# Altium schematic sheet mPCIe_LoRa_LTE_RS.SchDoc
size 420 x 297 mm; Scale: 1:1; DocumentType: Схема электрическая принципиальная; SheetNumber: 15; SheetTotal: 23; DocumentTypeShort: Э3; DocumentInvertoryNumber: ㅤ
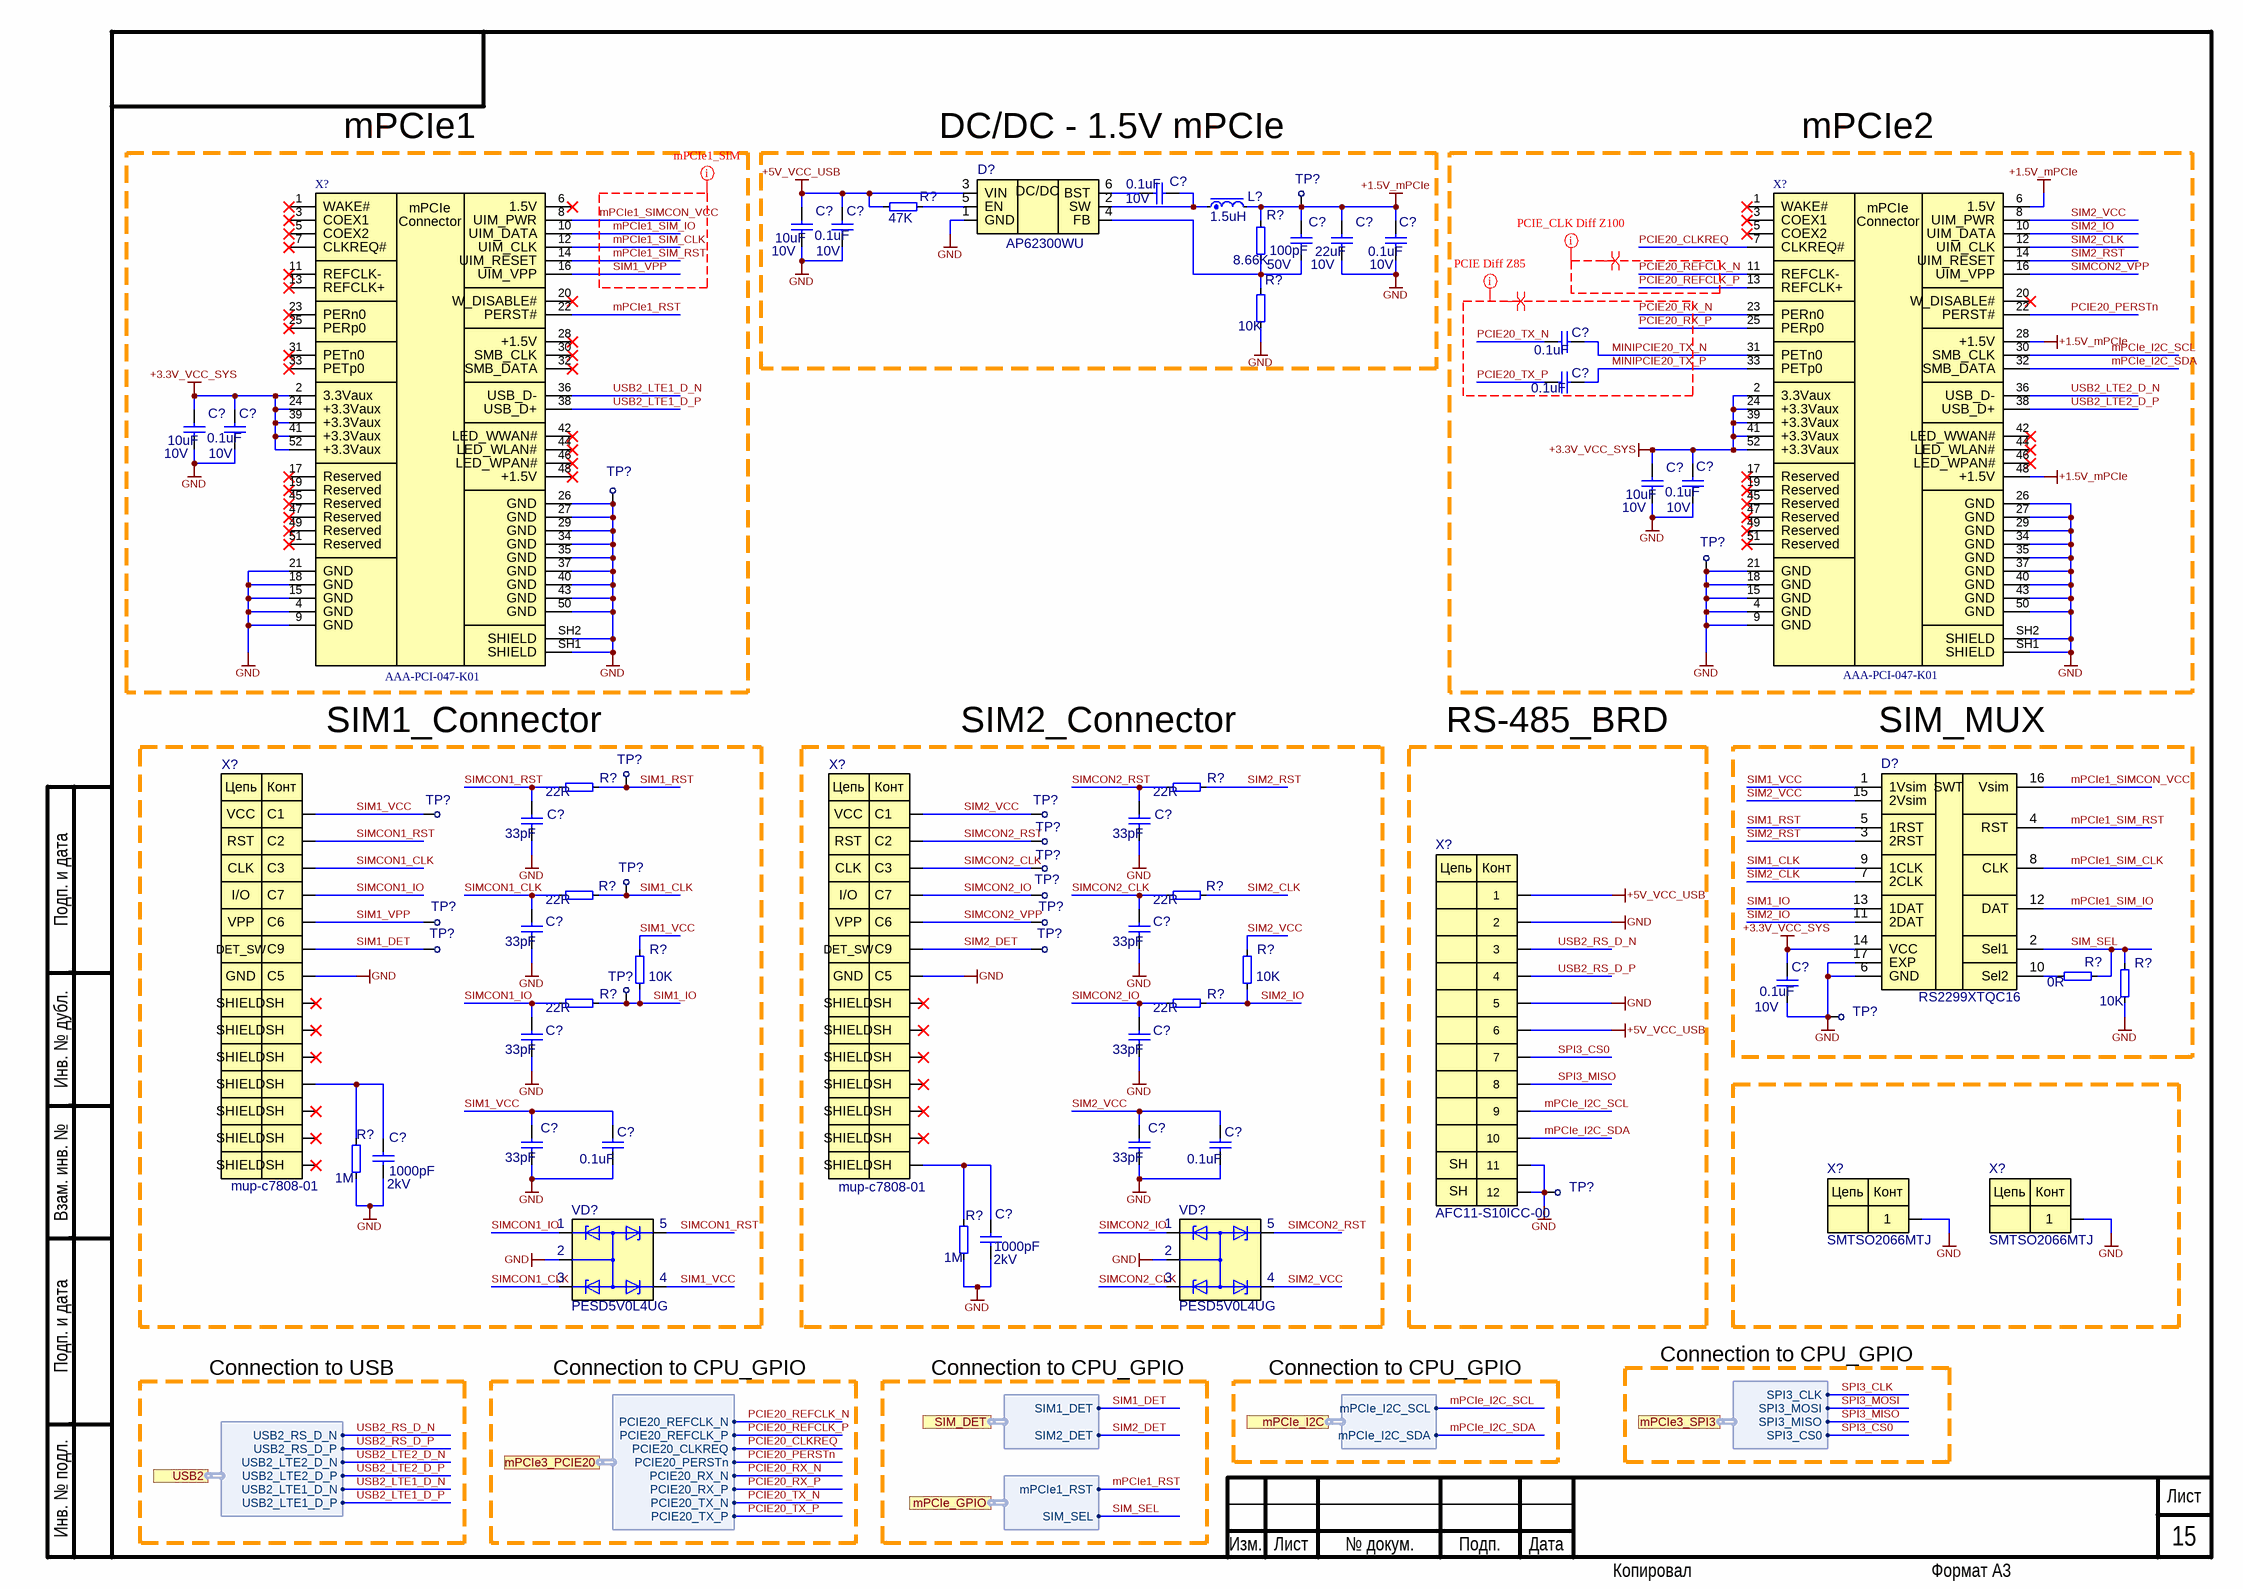
[diagram p0: mPCIe_LoRa_LTE_RS.SchDoc]

## Parts
(Parts that share a designator on the sheet are numbered #1, #2 ... from top to bottom, then left to right.)
C?#1  0.1uF  Voltage: 10V  [C0402]
C?#2  100pF  Voltage: 50V  [C0402]
C?#3  10uF  Voltage: 10V  [C0402]
C?#4  0.1uF  Voltage: 10V  [C0402]
C?#5  22uF  Voltage: 10V  [C0603]
C?#6  0.1uF  Voltage: 10V  [C0402]
C?#7  0.1uF  [C0201]
C?#8  0.1uF  [C0201]
C?#9  10uF  Voltage: 10V  [C0402]
C?#10  0.1uF  Voltage: 10V  [C0402]
C?#11  10uF  Voltage: 10V  [C0402]
C?#12  0.1uF  Voltage: 10V  [C0402]
C?#13  33pF  [C0402]
C?#14  33pF  [C0402]
C?#15  33pF  [C0402]
C?#16  33pF  [C0402]
C?#17  0.1uF  Voltage: 10V  [C0402]
C?#18  33pF  [C0402]
C?#19  33pF  [C0402]
C?#20  33pF  [C0402]
C?#21  0.1uF  [C0402]
C?#22  33pF  [C0402]
C?#23  0.1uF  [C0402]
C?#24  1000pF  Voltage: 2kV  [C1206]
C?#25  1000pF  Voltage: 2kV  [C1206]
D?#1  AP62300WU  [TSOT26]
D?#2  RS2299XTQC16  [RS2299XTQC16]
L?  1.5uH  [L1210]
R?#1  47K  [R_0402]
R?#2  8.66K  [R_0402]
R?#3  10K  [R_0402]
R?#4  22R  [R_0402]
R?#5  22R  [R_0402]
R?#6  22R  [R_0402]
R?#7  22R  [R_0402]
R?#8  0R  [R_0402]
R?#9  10K  [R_0402]
R?#10  10K  [R_0402]
R?#11  22R  [R_0402]
R?#12  22R  [R_0402]
R?#13  10K  [R_0402]
R?#14  1M  [R_1206]
R?#15  1M  [R_1206]
TP?#1  Тестовая точка  [TEST]  (value not drawn)  (no BOM)
TP?#2  Тестовая точка  [TEST]  (value not drawn)  (no BOM)
TP?#3  Тестовая точка  [TEST]  (value not drawn)  (no BOM)
TP?#4  Тестовая точка  [TEST]  (value not drawn)  (no BOM)
TP?#5  Тестовая точка  [TEST]  (value not drawn)  (no BOM)
TP?#6  Тестовая точка  [TEST]  (value not drawn)  (no BOM)
TP?#7  Тестовая точка  [TEST]  (value not drawn)  (no BOM)
TP?#8  Тестовая точка  [TEST]  (value not drawn)  (no BOM)
TP?#9  Тестовая точка  [TEST]  (value not drawn)  (no BOM)
TP?#10  Тестовая точка  [TEST]  (value not drawn)  (no BOM)
TP?#11  Тестовая точка  [TEST]  (value not drawn)  (no BOM)
TP?#12  Тестовая точка  [TEST]  (value not drawn)  (no BOM)
TP?#13  Тестовая точка  [TEST]  (value not drawn)  (no BOM)
TP?#14  Тестовая точка  [TEST]  (value not drawn)  (no BOM)
TP?#15  Тестовая точка  [TEST]  (value not drawn)  (no BOM)
TP?#16  Тестовая точка  [TEST]  (value not drawn)  (no BOM)
TP?#17  Тестовая точка  [TEST]  (value not drawn)  (no BOM)
VD?#1  PESD5V0L4UG  [TSSOP5-5]
VD?#2  PESD5V0L4UG  [TSSOP5-5]
X?#1  AAA-PCI-047-K01  [AAA-PCI-047-K01]
X?#2  AAA-PCI-047-K01  [AAA-PCI-047-K01]
X?#3  mup-c7808-01  [mup-c7808]
X?#4  mup-c7808-01  [mup-c7808]
X?#5  AFC11-S10ICC-00  [AFC11-S10ICC-00]
X?#6  SMTSO2066MTJ  [SMTSO2066MTJ]
X?#7  SMTSO2066MTJ  [SMTSO2066MTJ]

## Ports
mPCIe3_PCIE20 (harness mPCIe3_PCIE20), mPCIe3_SPI3 (harness mPCIe3_SPI3), mPCIe_GPIO (harness mPCIe_GPIO), mPCIe_I2C (harness mPCIe_I2C), SIM_DET (harness SIM_DET), USB2 (harness USB2)

## Harnesses
USB2: USB2_RS_D_P, USB2_RS_D_N, USB2_LTE2_D_P, USB2_LTE2_D_N, USB2_LTE1_D_P, USB2_LTE1_D_N
mPCIe3_PCIE20: PCIE20_REFCLK_P, PCIE20_REFCLK_N, PCIE20_RX_P, PCIE20_RX_N, PCIE20_TX_P, PCIE20_TX_N, PCIE20_PERSTn, PCIE20_CLKREQ
mPCIe_GPIO: SIM_SEL, mPCIe1_RST
SIM_DET: SIM1_DET, SIM2_DET
mPCIe_I2C: mPCIe_I2C_SDA, mPCIe_I2C_SCL
mPCIe3_SPI3: SPI3_MOSI, SPI3_CS0, SPI3_MISO, SPI3_CLK

## Nets
+1.5V_mPCIe: C?#2.1 C?#5.2 C?#6.2 L?.2 R?#2.2 TP?#1.1 X?#2.6(1.5V) X?#2.28(+1.5V) X?#2.48(+1.5V)
+3.3V_VCC_SYS: C?#9.2 C?#10.2 C?#11.2 C?#12.2 C?#17.2 D?#2.14(VCC) X?#1.2(3.3Vaux) X?#1.24(+3.3Vaux) X?#1.39(+3.3Vaux) X?#1.41(+3.3Vaux) X?#1.52(+3.3Vaux) X?#2.2(3.3Vaux) X?#2.24(+3.3Vaux) X?#2.39(+3.3Vaux) X?#2.41(+3.3Vaux) X?#2.52(+3.3Vaux)
+5V_VCC_USB: C?#3.2 C?#4.2 D?#1.3(VIN) R?#1.2 X?#5.1 X?#5.6
GND: C?#3.1 C?#4.1 C?#5.1 C?#6.1 C?#9.1 C?#10.1 C?#11.1 C?#12.1 C?#13.1 C?#14.1 C?#15.1 C?#16.1 C?#17.1 C?#18.1 C?#19.1 C?#20.1 C?#21.1 C?#22.1 C?#23.1 C?#24.1 C?#25.1 D?#1.1(GND) D?#2.6(GND) D?#2.17(EXP) R?#3.1 R?#13.1 R?#14.1 R?#15.1 TP?#2.1 TP?#3.1 TP?#16.1 TP?#17.1 VD?#1.2 VD?#2.2 X?#1.4(GND) X?#1.9(GND) X?#1.15(GND) X?#1.18(GND) X?#1.21(GND) X?#1.26(GND) X?#1.27(GND) X?#1.29(GND) X?#1.34(GND) X?#1.35(GND) X?#1.37(GND) X?#1.40(GND) X?#1.43(GND) X?#1.50(GND) X?#1.SH1(SHIELD) X?#1.SH2(SHIELD) X?#2.4(GND) X?#2.9(GND) X?#2.15(GND) X?#2.18(GND) X?#2.21(GND) X?#2.26(GND) X?#2.27(GND) X?#2.29(GND) X?#2.34(GND) X?#2.35(GND) X?#2.37(GND) X?#2.40(GND) X?#2.43(GND) X?#2.50(GND) X?#2.SH1(SHIELD) X?#2.SH2(SHIELD) X?#3.C5 X?#4.C5 X?#5.2 X?#5.5 X?#5.11 X?#5.12 X?#6.1 X?#7.1
MINIPCIE20_TX_N: C?#7.2 X?#2.31(PETn0)
MINIPCIE20_TX_P: C?#8.2 X?#2.33(РЕТр0)
mPCIe1_RST: X?#1.22(PERST#) ; port mPCIe_GPIO.mPCIe1_RST
mPCIe1_SIM_CLK: D?#2.8(CLK) X?#1.12(UIM_CLK)
mPCIe1_SIM_IO: D?#2.12(DAT) X?#1.10(UIM_DATA)
mPCIe1_SIM_RST: D?#2.4(RST) X?#1.14(UIM_RESET)
mPCIe1_SIMCON_VCC: D?#2.16(Vsim) X?#1.8(UIM_PWR)
mPCIe_I2C_SCL: X?#2.30(SMB_CLK) X?#5.9 ; port mPCIe_I2C.mPCIe_I2C_SCL
mPCIe_I2C_SDA: X?#2.32(SMB_DATA) X?#5.10 ; port mPCIe_I2C.mPCIe_I2C_SDA
PCIE20_CLKREQ: X?#2.7(CLKREQ#) ; port mPCIe3_PCIE20.PCIE20_CLKREQ
PCIE20_PERSTn: X?#2.22(PERST#) ; port mPCIe3_PCIE20.PCIE20_PERSTn
PCIE20_REFCLK_N: X?#2.11(REFCLK-) ; port mPCIe3_PCIE20.PCIE20_REFCLK_N
PCIE20_REFCLK_P: X?#2.13(REFCLK+) ; port mPCIe3_PCIE20.PCIE20_REFCLK_P
PCIE20_RX_N: X?#2.23(PERn0) ; port mPCIe3_PCIE20.PCIE20_RX_N
PCIE20_RX_P: X?#2.25(PERp0) ; port mPCIe3_PCIE20.PCIE20_RX_P
PCIE20_TX_N: C?#7.1 ; port mPCIe3_PCIE20.PCIE20_TX_N
PCIE20_TX_P: C?#8.1 ; port mPCIe3_PCIE20.PCIE20_TX_P
SIM1_CLK: D?#2.9(1CLK) R?#6.2 TP?#9.1
SIM1_DET: TP?#13.1 X?#3.C9 ; port SIM_DET.SIM1_DET
SIM1_IO: D?#2.13(1DAT) R?#9.1 R?#11.2 TP?#15.1
SIM1_RST: D?#2.5(1RST) R?#4.2 TP?#4.1
SIM1_VCC: C?#20.2 C?#21.2 D?#2.1(1Vsim) R?#9.2 TP?#5.1 VD?#1.4 X?#3.C1
SIM1_VPP: TP?#11.1 X?#1.16(UIM_VPP) X?#3.C6
SIM2_CLK: D?#2.7(2CLK) R?#7.2 X?#2.12(UIM_CLK)
SIM2_DET: TP?#14.1 X?#4.C9 ; port SIM_DET.SIM2_DET
SIM2_IO: D?#2.11(2DAT) R?#10.1 R?#12.2 X?#2.10(UIM_DATA)
SIM2_RST: D?#2.3(2RST) R?#5.2 X?#2.14(UIM_RESET)
SIM2_VCC: C?#22.2 C?#23.2 D?#2.15(2Vsim) R?#10.2 TP?#6.1 VD?#2.4 X?#2.8(UIM_PWR) X?#4.C1
SIM_SEL: D?#2.2(Sel1) R?#8.2 R?#13.2 ; port mPCIe_GPIO.SIM_SEL
SIMCON1_CLK: C?#15.2 R?#6.1 VD?#1.3 X?#3.C3
SIMCON1_IO: C?#18.2 R?#11.1 VD?#1.1 X?#3.C7
SIMCON1_RST: C?#13.2 R?#4.1 VD?#1.5 X?#3.C2
SIMCON2_CLK: C?#16.2 R?#7.1 TP?#8.1 VD?#2.3 X?#4.C3
SIMCON2_IO: C?#19.2 R?#12.1 TP?#10.1 VD?#2.1 X?#4.C7
SIMCON2_RST: C?#14.2 R?#5.1 TP?#7.1 VD?#2.5 X?#4.C2
SIMCON2_VPP: TP?#12.1 X?#2.16(UIM_VPP) X?#4.C6
SPI3_CLK: port mPCIe3_SPI3.SPI3_CLK
SPI3_CS0: X?#5.7 ; port mPCIe3_SPI3.SPI3_CS0
SPI3_MISO: X?#5.8 ; port mPCIe3_SPI3.SPI3_MISO
SPI3_MOSI: port mPCIe3_SPI3.SPI3_MOSI
USB2_LTE1_D_N: X?#1.36(USB_D-) ; port USB2.USB2_LTE1_D_N
USB2_LTE1_D_P: X?#1.38(USB_D+) ; port USB2.USB2_LTE1_D_P
USB2_LTE2_D_N: X?#2.36(USB_D-) ; port USB2.USB2_LTE2_D_N
USB2_LTE2_D_P: X?#2.38(USB_D+) ; port USB2.USB2_LTE2_D_P
USB2_RS_D_N: X?#5.3 ; port USB2.USB2_RS_D_N
USB2_RS_D_P: X?#5.4 ; port USB2.USB2_RS_D_P
NetC?#1_1: C?#1.1 D?#1.2(SW) L?.1
NetC?#1_2: C?#1.2 D?#1.6(BST)
NetC?#2_2: C?#2.2 D?#1.4(FB) R?#2.1 R?#3.2
NetC?#24_2: C?#24.2 R?#14.2 X?#3.SH4(SH)
NetC?#25_2: C?#25.2 R?#15.2 X?#4.SH7(SH)
NetD?#1_5: D?#1.5(EN) R?#1.1
NetD?#2_10: D?#2.10(Sel2) R?#8.1

Not connected (* = marked no-connect by the designer): X?#1 1(WAKE#)* 3(СОЕХ1)* 5(СОЕХ2)* 6(1.5V)* 7(CLKREQ#)* 11(REFCLK-)* 13(REFCLK+)* 17(Reserved)* 19(Reserved)* 20(W_DISABLE#)* 23(PERn0)* 25(PERp0)* 28(+1.5V)* 30(SMB_CLK)* 31(PETn0)* 32(SMB_DATA)* 33(РЕТр0)* 42(LED_WWAN#)* 44(LED_WLAN#)* 45(Reserved)* 46(LED_WPAN#)* 47(Reserved)* 48(+1.5V)* 49(Reserved)* 51(Reserved)*; X?#2 1(WAKE#)* 3(СОЕХ1)* 5(СОЕХ2)* 17(Reserved)* 19(Reserved)* 20(W_DISABLE#)* 42(LED_WWAN#)* 44(LED_WLAN#)* 45(Reserved)* 46(LED_WPAN#)* 47(Reserved)* 49(Reserved)* 51(Reserved)*; X?#3 SH1(SH)* SH2(SH)* SH3(SH)* SH5(SH)* SH6(SH)* SH7(SH)*; X?#4 SH1(SH)* SH2(SH)* SH3(SH)* SH4(SH)* SH5(SH)* SH6(SH)*

## Layout directives
net class mPCIe1_SIM: mPCIe1_SIM_CLK, mPCIe1_SIM_IO, mPCIe1_SIM_RST, mPCIe1_SIMCON_VCC, SIM1_VPP
rule Differential Pairs Routing [Pref Gap = 0.127mm    Min Gap  = 0.127mm    Max Gap  = 0.127mmPref Width = 0.12mm    Min Width  = 0.12mm    Max Width  = 0.14mm]; net class PCIE_Z85: MINIPCIE20_TX_N, MINIPCIE20_TX_P, PCIE20_RX_N, PCIE20_RX_P, PCIE20_TX_N, PCIE20_TX_P
differential pair: MINIPCIE20_TX_N, MINIPCIE20_TX_P, PCIE20_REFCLK_N, PCIE20_REFCLK_P, PCIE20_RX_N, PCIE20_RX_P, PCIE20_TX_N, PCIE20_TX_P
rule Differential Pairs Routing [Pref Gap = 0.2mm    Min Gap  = 0.127mm    Max Gap  = 0.24mmPref Width = 0.11mm    Min Width  = 0.1mm    Max Width  = 0.12mm]; net class PCIE_CLK: PCIE20_REFCLK_N, PCIE20_REFCLK_P

## Notes on the sheet
- mPCIe1
- DC/DC - 1.5V mPCIe
- mPCIe2
- SIM1_Connector
- SIM2_Connector
- RS-485_BRD
- SIM_MUX
- Connection to USB
- Connection to CPU_GPIO
- Подп. и дата
- Инв. № дубл.
- Взам. инв. №
- Инв. № подл.
- Изм.
- Лист
- № докум.
- Подп.
- Дата
- Копировал
- Формат А3
- (in symbol AAA-PCI-047-K01) mPCIe; Connector
- (in symbol AFC11-S10ICC-00) Цепь; Конт; SH
- (in symbol AP62300WU) DC/DC
- (in symbol mup-c7808) Цепь; Конт; VCC; RST; CLK; I/O; VPP; DET_SW; GND; SHIELD
- (in symbol RS2299XTQC16) SWT
- (in symbol SMTSO2066MTJ) Цепь; Конт

## Library data of the parts
C?#1 C?#4 C?#6 C?#10 C?#12 C?#17 = 0402-X7R-16V-0.1uF±10%: Part Number: 0402-X5R-10V-0.1uF±10%; Manufacturer: Yageo; NameFromManufacturer: CC0402KRX5R6BB104; Place: S; Tolerance: 10%; Check: False; Value: 0.1uF; Temperature: -55°C~125°C; ComponentLink2Description: Link to datasheet; ComponentLink1Description: DATASHEET; Last changed: 27.10.2022
C?#2 = 0402-NP0-50V-100pF±5%: *; Manufacturer: Yageo; NameFromManufacturer: CC0402JRNPO9BN101; Place: S; Tolerance: 5%; Check: False; Part Number: 0402-NP0-50V-100pF±5%; Value: 100pF; Temperature: -55°C~125°C; ComponentLink2Description: Link to datasheet; ComponentLink1Description: DATASHEET; ComponentLink2URL: https://www.terraelectronica.ru/product/367375; ComponentLink1URL: Datasheets/capacitors/UPY-GP_NP0_16V-to-50V_18.pdf; Last changed: 27.10.2022
C?#3 C?#9 C?#11 = 0402-X5R-10V-10uF±20: *; Manufacturer: Samsung; NameFromManufacturer: CL05A106MP5NUNC; Place: S; Tolerance: 20%; Check: False; Part Number: 0402-X5R-10V-10uF±20; Value: 10uF; Temperature: -55°C~85°C; ComponentLink2Description: Link to datasheet; ComponentLink1Description: DATASHEET; Last changed: 06.04.2023
C?#5 = 0603-X5R-10V-22uF±20%: *; Manufacturer: Murata; NameFromManufacturer: GRM188R61A226ME15D; Place: S; Tolerance: 20%; Part Number: 0603-X5R-10V-22uF±20%; Value: 22uF; Temperature: -55°C~85°C; ComponentLink2Description: Link to datasheet; ComponentLink1Description: DATASHEET
C?#7 C?#8 = 0201-X5R-25V-0.1uF±10%: Manufacturer: Yageo; NameFromManufacturer: CC0201KRX5R8BB104; Place: S; Voltage: 25V; Tolerance: 10%; Check: False; Part Number: 0201-X5R-25V-0.1uF±10%; Value: 0.1uF; Temperature: -55°C~85°C; ComponentLink2Description: Link to datasheet; ComponentLink1Description: DATASHEET; ComponentLink2URL: https://octopart.com/cc0201krx5r8bb104-yageo-88496683?r=sp; ComponentLink1URL: Datasheets/capacitors/UPY-GPHC_X5R_4V-to-50V_26.pdf; Last changed: 27.10.2022
C?#13-C?#16 C?#18-C?#20 C?#22 = 0402-NP0-50V-033pF±5%: Manufacturer: Yageo; NameFromManufacturer: CC0402JRNPO9BN330; Place: S; Voltage: 50V; Tolerance: 5%; Check: False; Annotation: *; Param: *; Value: 33pF; Part Number: 0402-NP0-50V-033pF±5%; Temperature: -55°C~125°C; ComponentLink1Description: DATASHEET; ComponentLink1URL: https://ru.mouser.com/ProductDetail/YAGEO/CC0402JRNPO9BN330?qs=%2Fha2pyFadugad28DmURO4SjHY55hse1%2FbIxH0hu%252BjwDDDqlPhfn26g%3D%3D; Datasheet: #https://www.yageo.com/upload/media/product/productsearch/datasheet/mlcc/UPY-GP_NP0_16V-to-50V_18.pdf#; Last changed: 07.10.2021
C?#21 C?#23 = 0402-X7R-16V-0.1uF±10%: Manufacturer: Yageo; NameFromManufacturer: CC0402JRX7R7BB104; Place: S; Voltage: 16V; Tolerance: 10%; Check: False; Annotation: *; Param: *; Value: 0.1uF; Part Number: 0402-X7R-16V-0.1uF±10%; Temperature: -55°C~125°C; ComponentLink1Description: DATASHEET; ComponentLink1URL: https://www.yageo.com/upload/media/product/productsearch/datasheet/mlcc/UPY-GPHC_X7R_6.3V-to-50V_18.pdf; Datasheet: #https://www.yageo.com/upload/media/product/productsearch/datasheet/mlcc/UPY-GPHC_X7R_6.3V-to-50V_18.pdf#; Last changed: 31.03.2021
C?#24 C?#25 = 1206-X7R-2K-1000pF±10%: Manufacturer: Walsin; NameFromManufacturer: 1206B102K202; Place: S; Tolerance: 10%; Check: False; Part Number: 1206-X7R-2K-1000pF±10%; Value: 1000pF; Temperature: -55°C~125°C; ComponentLink2Description: Link to datasheet; ComponentLink1Description: DATASHEET; ComponentLink2URL: https://www.lcsc.com/product-detail/Multilayer-Ceramic-Capacitors-MLCC-SMD-SMT_Walsin-Tech-Corp-1206B102K202_C77494.html; ComponentLink1URL: Datasheets/capacitors/1810261813_Walsin-Tech-Corp-1206B102K202_C77494.pdf#Datasheets/capacitors/1810261813_Walsin-Tech-Corp-1206B102K202_C77494.pdf#; Last changed: 05.12.2022
D?#1 = AP62300WU: 4.2V TO 18V INPUT, 3A LOW IQ SYNCHRONOUS BUCK CONVERTER; Manufacturer: Diodes Incorporated; Place: S; Check: False; Part Number: AP62300WU; Value: AP62300WU; Temperature: -40°C~125°C; NameFromManufacturer: AP62300WU; ComponentLink1Description: DATASHEET; ComponentLink1URL: https://ru.mouser.com/ProductDetail/Diodes-Incorporated/AP62300WU-7?qs=vHuUswq2%252Bsy87v186OJS%2FQ%3D%3D; Datasheet: Datasheets/power/AP62300_AP62301_AP62300T.pdf; Last changed: 27.10.2022
D?#2 = RS2299XTQC16: Analog Switches; Manufacturer: RUNIC Tech; Check: False; Part Number: RS2299XTQC16; Value: RS2299XTQC16; NameFromManufacturer: RS2299XTQC16
L? = 1210-1A-1.5uH±20%: *; Manufacturer: Taiyo Yuden; NameFromManufacturer: LBC3225T1R5MR; Place: S; Tolerance: 20%; Current: 1A; DC Resistance: 0.060R; Check: False; Part Number: 1210-1A-1.5uH±20%; Value: 1.5uH; Temperature: -40°C~105°C; ComponentLink1Description: DATASHEET; ComponentLink1URL: https://www.electronshik.ru/item/TAIYO/LBC3225T1R5MR; Datasheet: Datasheets/inductors/LSQCA322525T1R5MRSS.pdf; Last changed: 27.10.2022
R?#1 = 0402-0.0625W-47K-100ppm±1%: NameFromManufacturer: RC0402FR-0747KL; Manufacturer: Yageo; Place: S; Tolerance: 1%; Check: False; Part Number: 0402-0.0625W-47K-100ppm±1%; Value: 47K; Temperature: -55°C~155°C; ComponentLink1Description: DATASHEET; ComponentLink1URL: https://www.terraelectronica.ru/pdf/show?pdf_file=%252Fds%252Fpdf%252FR%252FRC0402.pdf; Datasheet: Datasheets/resistors/PYu-RC_Group_51_RoHS_L_12.pdf; Last changed: 27.10.2022
R?#2 = 0402-0.0625W-48.7K-100ppm±1%: Part Number: 0402-0.0625W-8.66K-100ppm±1%; NameFromManufacturer: RC0402FR-078K66L; Manufacturer: Yageo; Place: S; Tolerance: 1%; Check: False; Value: 8.66K; Temperature: -55°C~155°C; ComponentLink1Description: DATASHEET; ComponentLink1URL: https://www.terraelectronica.ru/product/1871035; Datasheet: Datasheets/resistors/PYu-RC_Group_51_RoHS_L_12.pdf; Last changed: 27.10.2022
R?#3 = 0402-0.0625W-10K-100ppm±1%: NameFromManufacturer: RC0402FR-0710KL; Manufacturer: Yageo; Place: S; Tolerance: 1%; Check: False; Part Number: 0402-0.0625W-10K-100ppm±1%; Value: 10K; Temperature: -55°C~155°C; ComponentLink1Description: DATASHEET; ComponentLink1URL: https://ru.mouser.com/ProductDetail/YAGEO/RC0402FR-0710KL?qs=%2Fha2pyFaduhjtLcYvKXQ8IogF7YwN7YtH%252BOO8ZtEEMnoa4yoWYcwpw%3D%3D; Datasheet: Datasheets/resistors/PYu-RC_Group_51_RoHS_L_11.pdf; Last changed: 27.10.2022
R?#4-R?#7 R?#11 R?#12 = 0402-0.0625W-22R-100ppm±1%: NameFromManufacturer: RC0402FR-0722RL; Manufacturer: Yageo; Place: S; Tolerance: 1%; Check: False; Annotation: *; Param: *; Value: 22R; Part Number: 0402-0.0625W-22R-100ppm±1%; Temperature: -55°C~155°C; ComponentLink1Description: DATASHEET; ComponentLink1URL: https://www.yageo.com/upload/media/product/productsearch/datasheet/rchip/PYu-RC_Group_51_RoHS_L_11.pdf; Datasheet: #https://www.yageo.com/upload/media/product/productsearch/datasheet/rchip/PYu-RC_Group_51_RoHS_L_11.pdf#; Last changed: 10.06.2021
R?#8 = 0402-0.0625W-0R-100ppm±1%: NameFromManufacturer: RC0402FR-070RL; Manufacturer: Yageo; Place: S; Tolerance: 1%; Check: False; Part Number: 0402-0.0625W-0R-100ppm±1%; Value: 0R; Temperature: -55°C~155°C; ComponentLink1Description: DATASHEET; ComponentLink1URL: https://www.chipdip.ru/product0/8000617426?ysclid=l7og5x0plo427794326; Datasheet: Datasheets/resistors/DOC012445956.pdf; Last changed: 27.10.2022
R?#9 R?#10 R?#13 = 0402-0.0625W-10K-100ppm±5%: NameFromManufacturer: RC0402JR-0710KL; Manufacturer: Yageo; Place: S; Tolerance: 5%; Check: False; Annotation: *; Param: *; Value: 10K; Part Number: 0402-0.0625W-10K-100ppm±5%; Temperature: -55°C~155°C; ComponentLink1Description: DATASHEET; ComponentLink1URL: https://ru.mouser.com/ProductDetail/YAGEO/RC0402JR-0710KL?qs=%2Fha2pyFadugNN0LzwXn2qF8HRAp201xOpXu%252BapQnyvRGE%2F%252Bpr1TWjQ%3D%3D; Datasheet: #https://www.yageo.com/upload/media/product/productsearch/datasheet/rchip/PYu-RC_Group_51_RoHS_L_11.pdf#; Last changed: 12.10.2021
R?#14 R?#15 = 1206-0.25W-0R-200ppm±1%: Part Number: 1206-0.25W-1M-200ppm±1%; NameFromManufacturer: RC1206FR-071ML; Manufacturer: Yageo; Place: S; Tolerance: 1%; Check: False; Value: 1M; Temperature: -55°C~155°C; ComponentLink1Description: DATASHEET; ComponentLink1URL: https://www.yageo.com/upload/media/product/productsearch/datasheet/rchip/PYu-RC_Group_51_RoHS_L_11.pdf; Datasheet: Datasheets/resistors/PYu-RC_Group_51_RoHS_L_11.pdf; Last changed: 27.10.2022
TP?#1-TP?#17 = Тестовая точка: *; Check: False; Part Number: Тестовая точка; Value: Тестовая точка; ComponentLink1Description: DATASHEET; Manufacturer: *
VD?#1 VD?#2 = PESD5V0L4UG,115: Low capacitance unidirectional quadruple ESD protectiondiode arrays; Manufacturer: Tech Public Co.; Place: S; Check: False; Part Number: PESD5V0L4UG; Value: PESD5V0L4UG; Temperature: -65°C~150°C; ComponentLink1Description: DATASHEET; NameFromManufacturer: PESD5V0L4UG; ComponentLink1URL: https://ru.mouser.com/datasheet/2/916/PESDXL4UF_G_W-1599806.pdf; Last changed: 09.08.2021
  VD?#2: Datasheet: #https://ru.mouser.com/datasheet/2/916/PESDXL4UF_G_W-1599806.pdf#
X?#1 X?#2 = AAA-PCI-047-K01: mPCI-E Surface Mount 52 SMD,P=0.8mm Card Edge Connectors; Manufacturer: LOTES; Place: S; Check: False; Value: AAA-PCI-047-K01; Part Number: AAA-PCI-047-K01; NameFromManufacturer: AAA-PCI-047-K01; ComponentLink1Description: DATASHEET; Last changed: 24.03.2023
X?#3 X?#4 = mup-c7808: Manufacturer: MUP; Check: False; Part Number: mup-c7808-01; Value: mup-c7808-01; NameFromManufacturer: mup-c7808-01
X?#5 = AFC11-S10ICC-00: Manufacturer: JUSHUO; Check: False; Part Number: AFC11-S10ICC-00; Value: AFC11-S10ICC-00; NameFromManufacturer: AFC11-S10ICC-00
X?#6 X?#7 = SMTSO2066MTJ: Manufacturer: Sinhoo; Check: False; Part Number: SMTSO2066MTJ; Value: SMTSO2066MTJ; NameFromManufacturer: SMTSO2066MTJ